# EAGLE design avr (EAGLE 5.07)
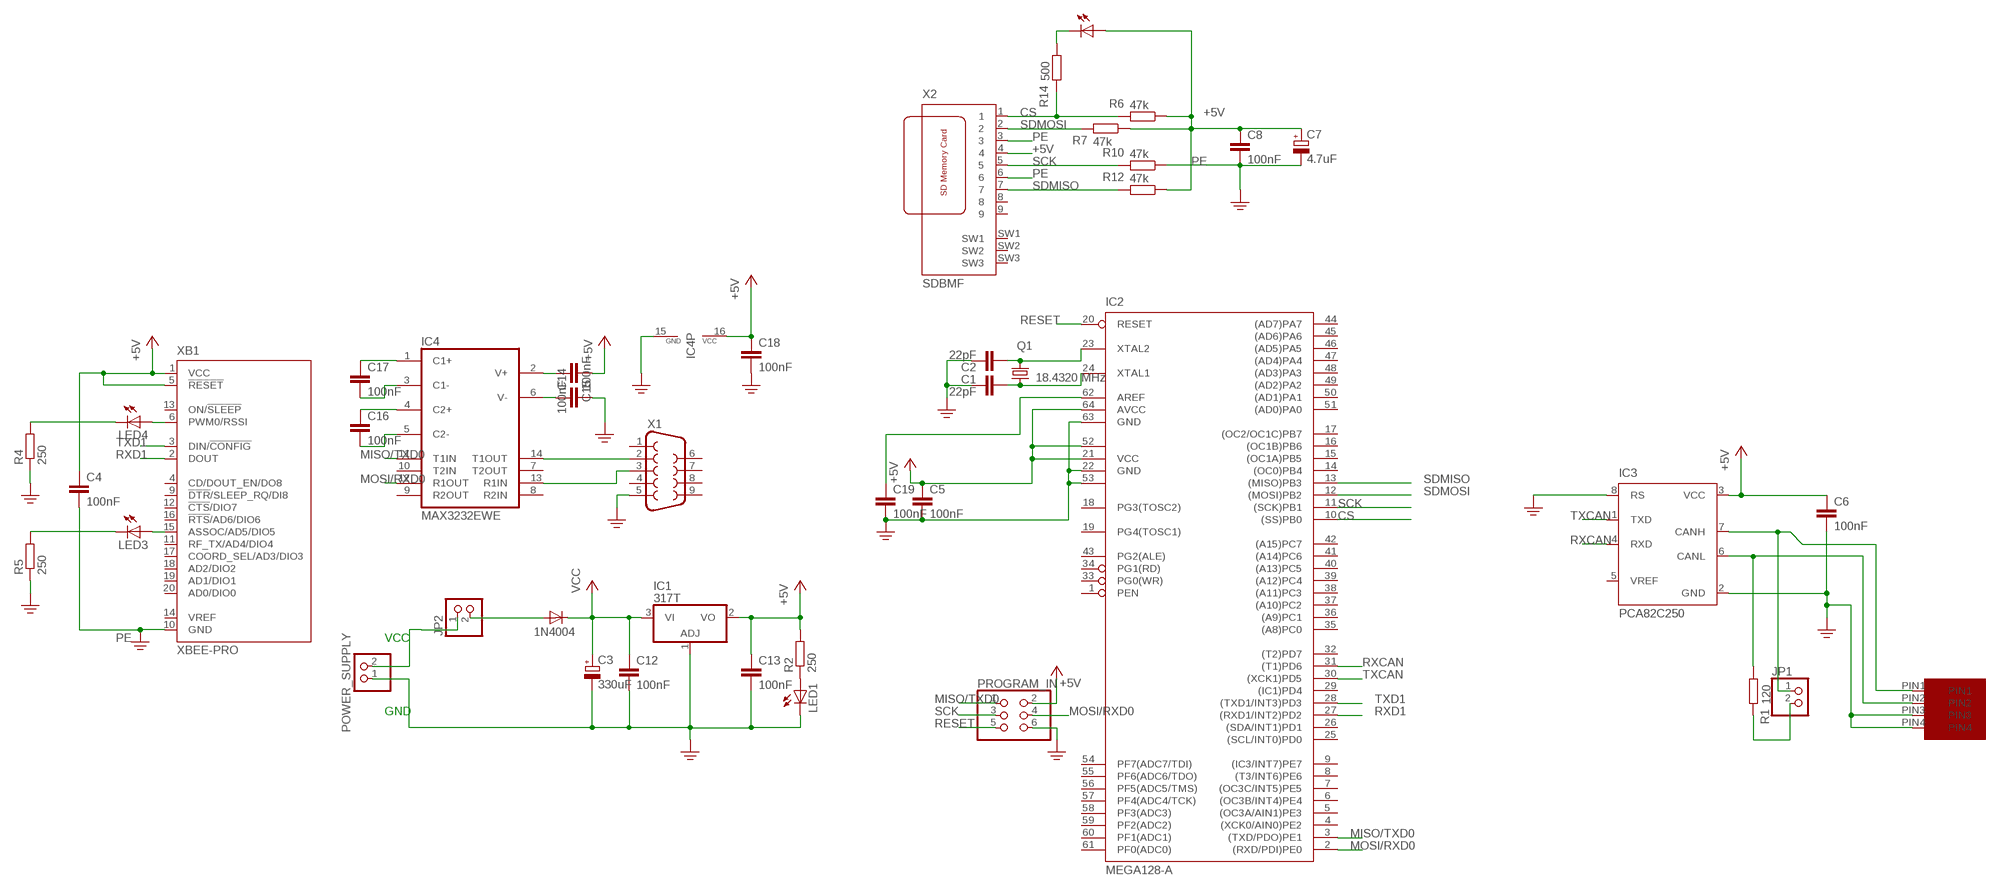
[diagram p0: schematic, sheet 1]

## Parts
C1  22pF  C5/2.5  [C5B2.5]
C2  22pF  C5/2.5  [C5B2.5]
C3  330uF  CPOL-EUE15-5AXIAL  [E15-5]
C4  100nF  C-EU050-024X044  [C050-024X044]
C5  100nF  C-EU050-024X044  [C050-024X044]
C6  100nF  C-EU050-024X044  [C050-024X044]
C7  4.7uF  CPOL-EUE15-5AXIAL  [E15-5]
C8  100nF  C-EU050-024X044  [C050-024X044]
C12  100nF  C-EU050-024X044  [C050-024X044]
C13  100nF  C-EU050-024X044  [C050-024X044]
C14  100nF  C-EU050-024X044  [C050-024X044]
C15  100nF  C-EU050-024X044  [C050-024X044]
C16  100nF  C-EU050-024X044  [C050-024X044]
C17  100nF  C-EU050-024X044  [C050-024X044]
C18  100nF  C-EU050-024X044  [C050-024X044]
C19  100nF  C-EU050-024X044  [C050-024X044]
D1  1N4004  [DO41-10]
IC1  317T  [TO220H]
IC2  MEGA128-A  [TQFP64]
IC3  PCA82C250  [DIL08]
IC4  MAX3232EWE  [SO16L]
JP1  PINHD-1X2  [1X02]
JP2  PINHD-1X2  [1X02]
LED1  LED5MM  [LED5MM]
LED3  LED5MM  [LED5MM]
LED4  LED5MM  [LED5MM]
LED5  LED5MM  [LED5MM]
POWER_SUPPLY  PINHD-1X2  [1X02]
PROGRAM_IN  PINHD-2X3  [2X03]
Q1  18.4320 MHz  CRYSTALHC49U70  [HC49U70]
R1  120  R-EU_0207/10  [0207/10]
R2  250  R-EU_0207/10  [0207/10]
R4  250  R-EU_0207/10  [0207/10]
R5  250  R-EU_0207/10  [0207/10]
R6  47k  R-EU_0207/10  [0207/10]
R7  47k  R-EU_0207/10  [0207/10]
R10  47k  R-EU_0207/10  [0207/10]
R12  47k  R-EU_0207/10  [0207/10]
R14  500  R-EU_0207/10  [0207/10]
U$1  MICROFIT4  [MICROFIT4SOCK]
X1  F09HP  [F09HP]
X2  SDBMF  [SDBMF-009XXBXX2]
XB1  XBEE-PRO  [XBEE-PRO]

## Nets
+5V: C4.1 C5.1 C6.1 C7.+ C8.1 C13.1 C15.1 C18.1 IC1.2(VO) IC2.21(VCC) IC2.52(VCC1) IC2.64(AVCC) IC3.3(VCC) IC4.16(VCC) LED5.A PROGRAM_IN.2 R2.2 R6.1 R7.1 R12.1 X2.4 XB1.1(VCC) XB1.5(!RESET)
CANJUMP1: IC3.7(CANH) JP1.1 U$1.PIN1
CANJUMP2: JP1.2 R1.2
CS: IC2.10((SS)PB0) R6.2 R14.2 X2.1
MISO/TXD0: IC2.3((TXD/PDO)PE1) IC4.11(T1IN) PROGRAM_IN.1
MOSI/RXD0: IC2.2((RXD/PDI)PE0) IC4.12(R1OUT) PROGRAM_IN.4
N$1: C1.2 IC2.24(XTAL1) Q1.1
N$2: C2.2 IC2.23(XTAL2) Q1.2
N$4: D1.A JP2.2
N$5: JP2.1 POWER_SUPPLY.2
N$6: LED1.A R2.1
N$10: C19.1 IC2.62(AREF)
N$21: IC4.13(R1IN) X1.3
N$33: IC4.14(T1OUT) X1.2
N$35: C17.1 IC4.1(C1+)
N$36: C17.2 IC4.3(C1-)
N$37: C16.1 IC4.4(C2+)
N$38: C16.2 IC4.5(C2-)
N$39: C14.1 IC4.6(V-)
N$41: C15.2 IC4.2(V+)
N$50: LED4.A XB1.6(PWM0/RSSI)
N$51: IC3.6(CANL) R1.1 U$1.PIN2
N$52: LED3.A XB1.15(ASSOC/AD5/DIO5)
N$57: LED4.K(C) R4.2
N$58: LED3.K(C) R5.2
N$59: LED5.K(C) R14.1
PE: C1.1 C2.1 C3.- C4.2 C5.2 C6.2 C7.- C8.2 C12.2 C13.2 C14.2 C18.2 C19.2 IC1.1(ADJ) IC2.22(GND) IC2.53(GND1) IC2.63(GND) IC3.2(GND) IC3.8(RS) IC4.15(GND) LED1.K(C) POWER_SUPPLY.1 PROGRAM_IN.6 R4.1 R5.1 R10.1 U$1.PIN3 U$1.PIN4 X1.5 X2.3 X2.6 XB1.10(GND)
RESET: IC2.20(RESET) PROGRAM_IN.5
RXCAN: IC2.31((T1)PD6) IC3.4(RXD)
RXD1: IC2.27((RXD1/INT2)PD2) XB1.2(DOUT)
SCK: IC2.11((SCK)PB1) PROGRAM_IN.3 R10.2 X2.5
SDMISO: IC2.13((MISO)PB3) R12.2 X2.7
SDMOSI: IC2.12((MOSI)PB2) R7.2 X2.2
TXCAN: IC2.30((XCK1)PD5) IC3.1(TXD)
TXD1: IC2.28((TXD1/INT3)PD3) XB1.3(DIN/!CONFIG)
VCC: C3.+ C12.1 D1.C IC1.3(VI)
Unconnected: IC2.1(PEN) IC2.4((XCK0/AIN0)PE2) IC2.5((OC3A/AIN1)PE3) IC2.6((OC3B/INT4)PE4) IC2.7((OC3C/INT5)PE5) IC2.8((T3/INT6)PE6) IC2.9((IC3/INT7)PE7) IC2.14((OC0)PB4) IC2.15((OC1A)PB5) IC2.16((OC1B)PB6) IC2.17((OC2/OC1C)PB7) IC2.18(PG3(TOSC2)) IC2.19(PG4(TOSC1)) IC2.25((SCL/INT0)PD0) IC2.26((SDA/INT1)PD1) IC2.29((IC1)PD4) IC2.32((T2)PD7) IC2.33(PG0(WR)) IC2.34(PG1(RD)) IC2.35((A8)PC0) IC2.36((A9)PC1) IC2.37((A10)PC2) IC2.38((A11)PC3) IC2.39((A12)PC4) IC2.40((A13)PC5) IC2.41((A14)PC6) IC2.42((A15)PC7) IC2.43(PG2(ALE)) IC2.44((AD7)PA7) IC2.45((AD6)PA6) IC2.46((AD5)PA5) IC2.47((AD4)PA4) IC2.48((AD3)PA3) IC2.49((AD2)PA2) IC2.50((AD1)PA1) IC2.51((AD0)PA0) IC2.54(PF7(ADC7/TDI)) IC2.55(PF6(ADC6/TDO)) IC2.56(PF5(ADC5/TMS)) IC2.57(PF4(ADC4/TCK)) IC2.58(PF3(ADC3)) IC2.59(PF2(ADC2)) IC2.60(PF1(ADC1)) IC2.61(PF0(ADC0)) IC3.5(VREF) IC4.7(T2OUT) IC4.8(R2IN) IC4.9(R2OUT) IC4.10(T2IN) X1.1 X1.4 X1.6 X1.7 X1.8 X1.9 X2.8 X2.9 X2.SW1 X2.SW2 X2.SW3 XB1.4(CD/DOUT_EN/DO8) XB1.9(!DTR!/SLEEP_RQ/DI8) XB1.11(RF_TX/AD4/DIO4) XB1.12(!CTS!/DIO7) XB1.13(ON/!SLEEP) XB1.14(VREF) XB1.16(!RTS!/AD6/DIO6) XB1.17(COORD_SEL/AD3/DIO3) XB1.18(AD2/DIO2) XB1.19(AD1/DIO1) XB1.20(AD0/DIO0)

## Notes on the sheet
- VCC
- GND

## Library data of the parts
C1 C2 = capacitor-wima:C: CAPACITOR naming: grid - package width
C3 C7 = rcl:CPOL-EU: POLARIZED CAPACITOR, European symbol
C4-C6 C8 C12-C19 = rcl:C-EU: CAPACITOR, European symbol
D1 = diode:1N4004: DIODE general purpose rectifier, 1 A
IC1 = linear:*317: Positive VOLTAGE REGULATOR
IC2 = atmel:MEGA128: MICROCONTROLLER 128 Kbytes FLASH 4 Kbytes SRAM 4 Kbytes EEPROM DUAL USART 8-channel 10 bit ADC Source: avr.lbr
IC3 = micro-philips:PCA82C250: CAN CONTROLLER INTERFACE
IC4 = maxim:MAX3232*: True RS-232 Transceivers 3.0V to 5.5V, Low-Power up to 1Mbps, Using Four 0.1µF External Capacitors Source: http://pdfserv.maxim-ic.com/en/ds/MAX3222-MAX3241.pdf
JP1 JP2 POWER_SUPPLY = pinhead:PINHD-1X2: PIN HEADER
LED1 LED3-LED5 = led:LED: LED OSRAM: - CHIPLED LG R971, LG N971, LY N971, LG Q971, LY Q971, LO R971, LY R971 LH N974, LH R974 LS Q976, LO Q976, LY Q976 LO Q996 - Hyper CHIPLED LW Q18S LB Q993, LB Q99A, LB R99A - SideLED LS A670, LO A670, LY A670, LG A670, LP A670 LB A673, LV A673, LT A673, LW A673 LH A674 LY A675 LS A676, LA A676, LO A676, LY A676, LW A676 LS A679, LY A679, LG A679 - Hyper Micro SIDELED® LS Y876, LA Y876, LO Y876, LY Y876 LT Y87S - SmartLED LW L88C, LW L88S LB L89C, LB L89S, LG L890 LS L89K, LO L89K, LY L89K LS L896, LA L896, LO L896, LY L896 - TOPLED LS T670, LO T670, LY T670, LG T670, LP T670 LSG T670, LSP T670, LSY T670, LOP T670, LYG T670 LG T671, LOG T671, LSG T671 LB T673, LV T673, LT T673, LW T673 LH T674 LS T676, LA T676, LO T676, LY T676, LB T676, LH T676, LSB T676, LW T676 LB T67C, LV T67C, LT T67C, LS T67K, LO T67K, LY T67K, LW E67C LS E67B, LA E67B, LO E67B, LY E67B, LB E67C, LV E67C, LT E67C LW T67C LS T679, LY T679, LG T679 LS T770, LO T770, LY T770, LG T770, LP T770 LB T773, LV T773, LT T773, LW T773 LH T774 LS E675, LA E675, LY E675, LS T675 LS T776, LA T776, LO T776, LY T776, LB T776 LHGB T686 LT T68C, LB T68C - Hyper Mini TOPLED® LB M676 - Mini TOPLED Santana® LG M470 LS M47K, LO M47K, LY M47K Source: http://www.osram.convergy.de LUXEON: - LUMILED® LXK2-PW12-R00, LXK2-PW12-S00, LXK2-PW14-U00, LXK2-PW14-V00 LXK2-PM12-R00, LXK2-PM12-S00, LXK2-PM14-U00 LXK2-PE12-Q00, LXK2-PE12-R00, LXK2-PE12-S00, LXK2-PE14-T00, LXK2-PE14-U00 LXK2-PB12-K00, LXK2-PB12-L00, LXK2-PB12-M00, LXK2-PB14-N00, LXK2-PB14-P00, LXK2-PB14-Q00 LXK2-PR12-L00, LXK2-PR12-M00, LXK2-PR14-Q00, LXK2-PR14-R00 LXK2-PD12-Q00, LXK2-PD12-R00, LXK2-PD12-S00 LXK2-PH12-R00, LXK2-PH12-S00 LXK2-PL12-P00, LXK2-PL12-Q00, LXK2-PL12-R00 Source: www.luxeon.com KINGBRIGHT: KA-3528ASYC Source: www.kingbright.com
PROGRAM_IN = pinhead:PINHD-2X3: PIN HEADER
Q1 = crystal:CRYSTAL: CRYSTAL
R1 R2 R4-R7 R10 R12 R14 = resistor:R-EU_: RESISTOR, European symbol
U$1 = UNICORN:MICROFIT4
X1 = con-subd:F09: SUB-D
X2 = farnell:SDBMF: SD MEMORY CARD PUSH-PUSH WITH CONNECTOR TYPE B (BIG SWUÌTCH #3) KINGFONT PRECISION INDUSTIAL CO., LTD Source: http://www.farnell.com/datasheets/74273.pdf Best.-Nr.: 9186174 Hersteller: MULTICOMP Herstellerbez.: SDBMF-00915B0T2
XB1 = maxstream:XBEE: XBee (TM) /XBee-PRO(TM) OEM RF Modules Source: MaxStream, Inc. xbee_productmanual.pdf

## Board
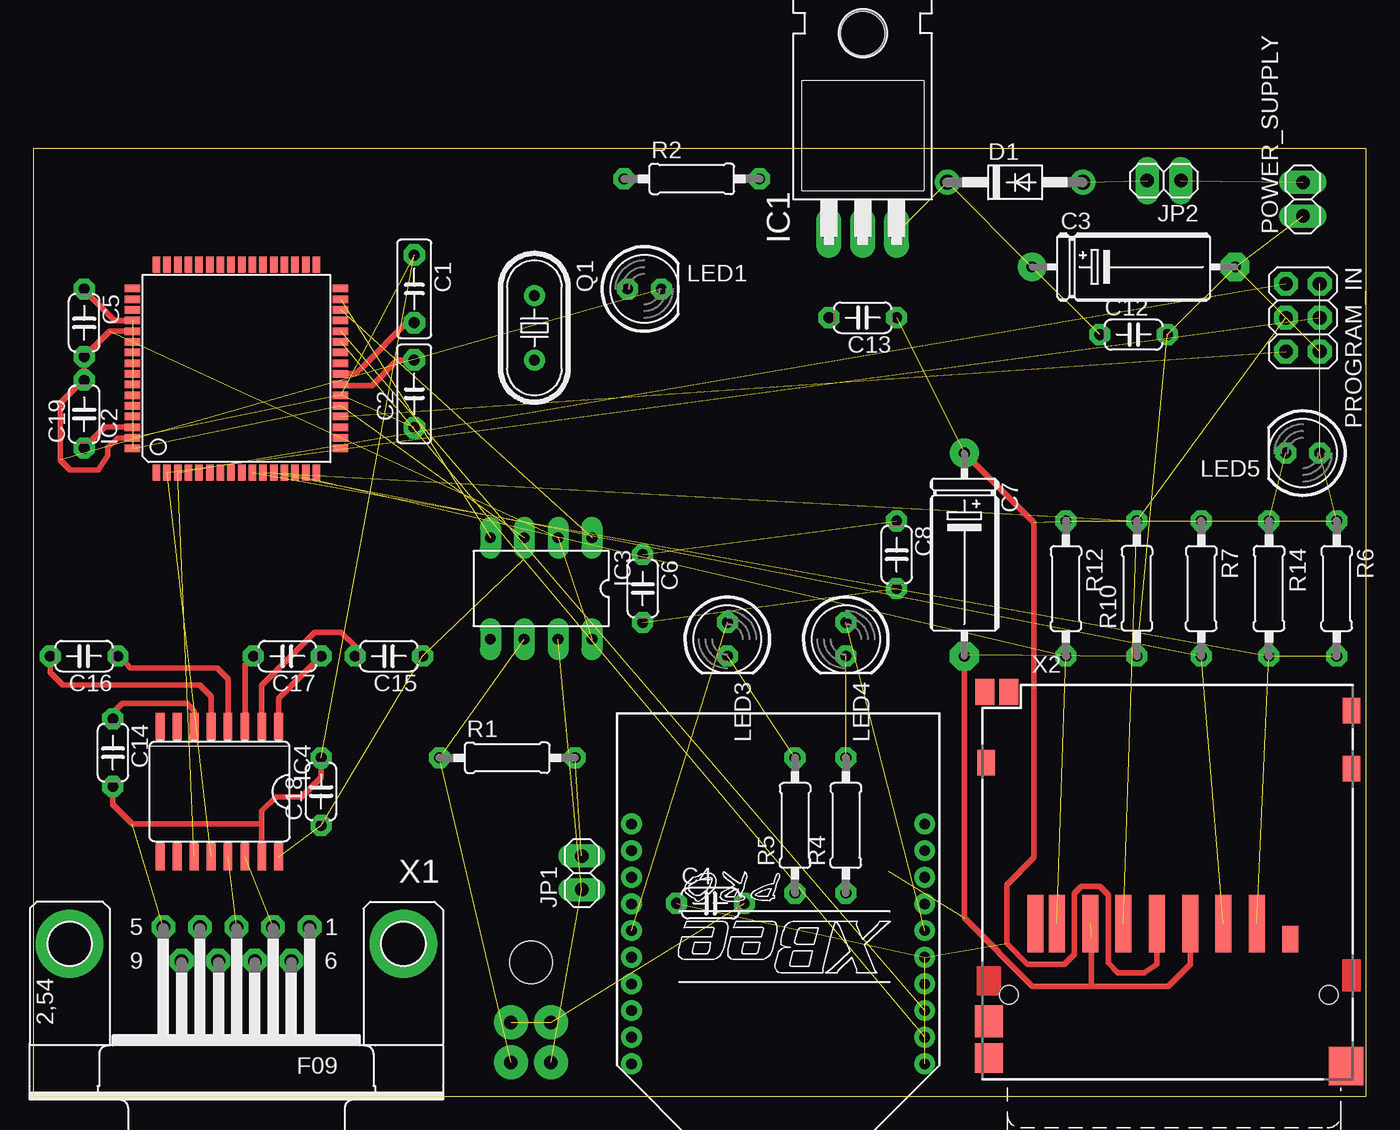
[diagram p1: board, top side]
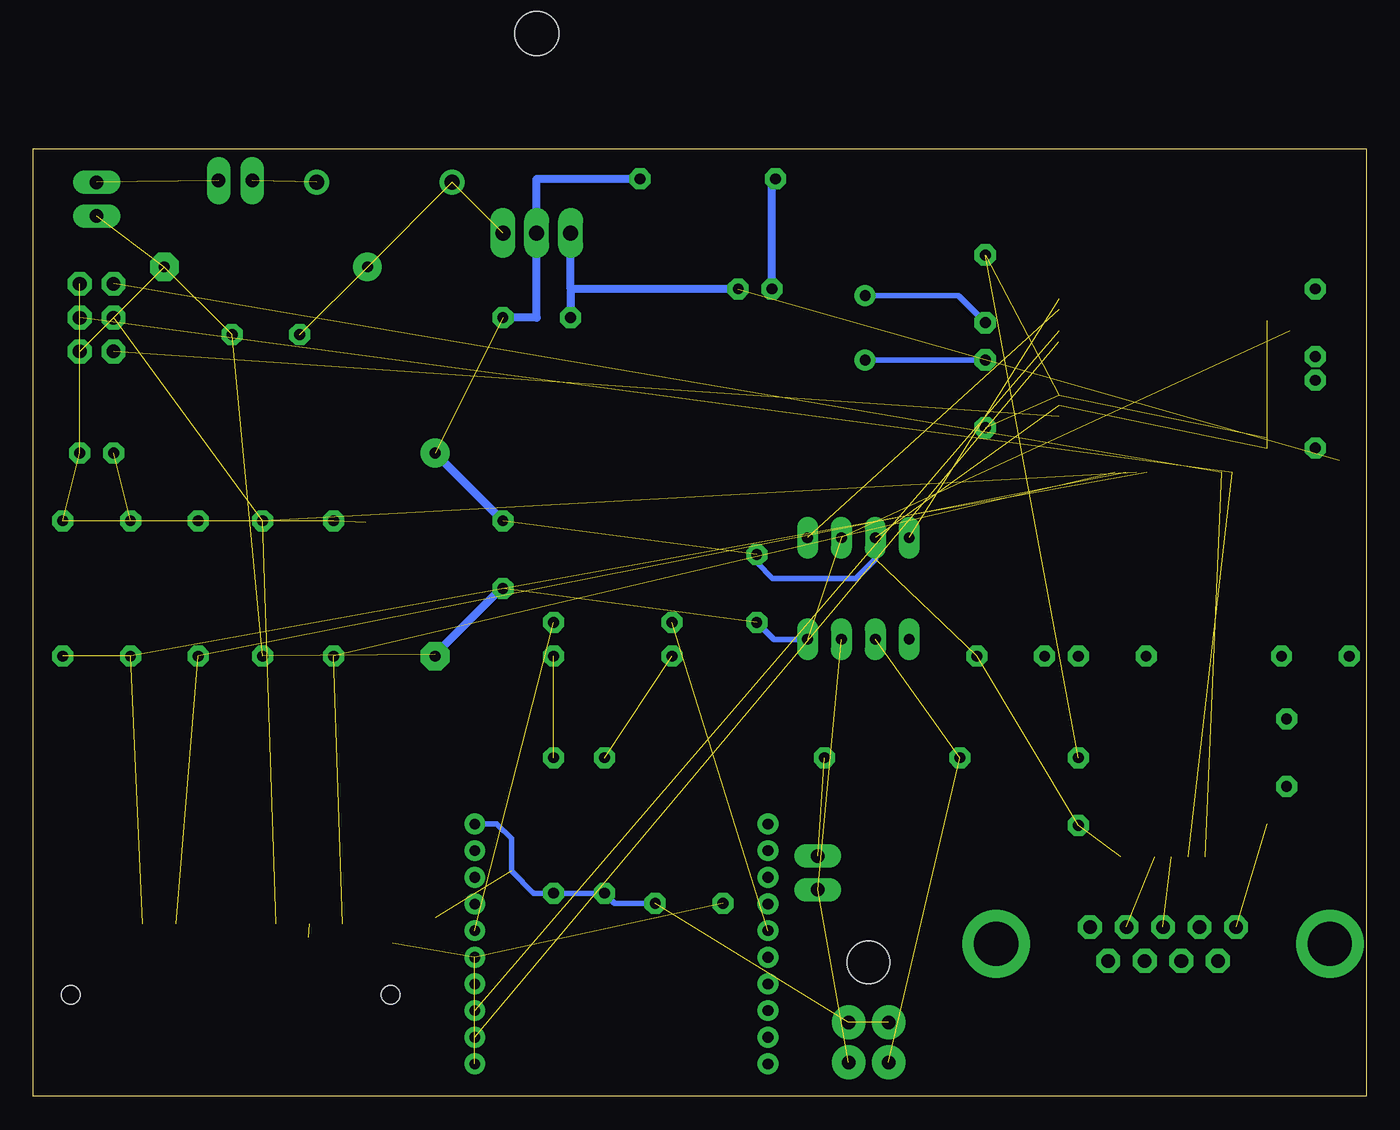
[diagram p2: board, bottom side, seen from below]

Size 100 x 71.11 mm. Coordinates in mm from the lower left corner, seen from the top.
Outline: 0,0 100,0 100,71.11 0,71.11 0,0
Copper layers (1*16): Top 0.035mm / dielectric 1.5mm / Bottom 0.035mm
Design rules "default *": minimum track width 10mil, minimum drill 24mil, track to track 12mil, track to pad 12mil, pad to pad 8mil, via to via 12mil, smd to smd 8mil, copper to edge 40mil, drill to drill 8mil, minimum pad ring 15mil, minimum via ring 8mil, stop-mask expansion 4mil, vias tented up to drill 0mil, thermal gap 10mil
tRestrict: area 43.2,1.3 to 45.7,21.6; area 66,1.3 to 68.6,21.6; area 33,40.6 to 43.2,43.2; area 33,33 to 43.2,35.6; area 35.4,1.9 to 39.2,7; area 34.3,1.3 to 40.6,6.3; area 59.7,31.8 to 62.2,36.8; area 50.8,31.8 to 53.3,35.6; area 50.8,35.6 to 53.3,36.8; area 92.7,47 to 97.8,49.5; area 94,64.8 to 96.5,69.8; area 92.7,54.6 to 97.8,62.2; 7 more areas

### Footprints (pad centres in the part's own frame; a part is rotated, then mirrored left to right if it is on the bottom)
C5B2.5 = drill 0.813 pad 1.6 octagon: 1 -2.54,0; 2 2.54,0
E15-5 = drill 0.813 pad 2.159 round: + -7.62,0 | drill 0.813 pad 2.159 octagon: - 7.62,0
C050-024X044 = drill 0.813 octagon: 1 -2.54,0; 2 2.54,0
DO41-10 = drill 1.118 round: A 5.08,0; C -5.08,0
TO220H = drill 1.118 long: 1 -2.54,-10.16; 2 0,-10.16; 3 2.54,-10.16 | hole 3.302: 0,4.826
TQFP64 = smd 1.194 x 0.559: 1 -7.8,6; 2 -7.8,5.2; 3 -7.8,4.4; 4 -7.8,3.6; 5 -7.8,2.8; 6 -7.8,2; 7 -7.8,1.2; 8 -7.8,0.4; 9 -7.8,-0.4; 10 -7.8,-1.2; 11 -7.8,-2; 12 -7.8,-2.8; 13 -7.8,-3.6; 14 -7.8,-4.4; 15 -7.8,-5.2; 16 -7.8,-6; 33 7.8,-6; 34 7.8,-5.2; 35 7.8,-4.4; 36 7.8,-3.6; 37 7.8,-2.8; 38 7.8,-2; 39 7.8,-1.2; 40 7.8,-0.4; 41 7.8,0.4; 42 7.8,1.2; 43 7.8,2; 44 7.8,2.8; 45 7.8,3.6; 46 7.8,4.4; 47 7.8,5.2; 48 7.8,6 | smd 0.559 x 1.194: 17 -6,-7.8; 18 -5.2,-7.8; 19 -4.4,-7.8; 20 -3.6,-7.8; 21 -2.8,-7.8; 22 -2,-7.8; 23 -1.2,-7.8; 24 -0.4,-7.8; 25 0.4,-7.8; 26 1.2,-7.8; 27 2,-7.8; 28 2.8,-7.8; 29 3.6,-7.8; 30 4.4,-7.8; 31 5.2,-7.8; 32 6,-7.8; 49 6,7.8; 50 5.2,7.8; 51 4.4,7.8; 52 3.6,7.8; 53 2.8,7.8; 54 2,7.8; 55 1.2,7.8; 56 0.4,7.8; 57 -0.4,7.8; 58 -1.2,7.8; 59 -2,7.8; 60 -2.8,7.8; 61 -3.6,7.8; 62 -4.4,7.8; 63 -5.2,7.8; 64 -6,7.8
DIL08 = drill 0.813 long: 1 -3.81,-3.81; 2 -1.27,-3.81; 3 1.27,-3.81; 4 3.81,-3.81; 5 3.81,3.81; 6 1.27,3.81; 7 -1.27,3.81; 8 -3.81,3.81
SO16L = smd 0.66 x 2.032: 1 -4.445,-4.902; 2 -3.175,-4.902; 3 -1.905,-4.902; 4 -0.635,-4.902; 5 0.635,-4.902; 6 1.905,-4.902; 7 3.175,-4.902; 8 4.445,-4.902; 9 4.445,4.902; 10 3.175,4.902; 11 1.905,4.902; 12 0.635,4.902; 13 -0.635,4.902; 14 -1.905,4.902; 15 -3.175,4.902; 16 -4.445,4.902
1X02 = drill 1.016 long: 1 -1.27,0; 2 1.27,0
LED5MM = drill 0.813 octagon: A -1.27,0; K 1.27,0
2X03 = drill 1.016 octagon: 1 -2.54,-1.27; 2 -2.54,1.27; 3 0,-1.27; 4 0,1.27; 5 2.54,-1.27; 6 2.54,1.27
HC49U70 = drill 0.813 round: 1 -2.413,0; 2 2.413,0
0207/10 = drill 0.813 octagon: 1 -5.08,0; 2 5.08,0
MICROFIT4SOCK = drill 1 pad 2.54 round: PIN1 -2,0; PIN2 1,0; PIN3 -2,-3; PIN4 1,-3 | hole 3.2: -0.5,-7.5
F09HP = drill 1.016 octagon: 1 -5.486,-1.27; 2 -2.743,-1.27; 3 0,-1.27; 4 2.743,-1.27; 5 5.486,-1.27; 6 -4.115,1.27; 7 -1.372,1.27; 8 1.372,1.27; 9 4.115,1.27 | drill 3.302 pad 5.08 round: G1 -12.522,0; G2 12.522,0
SDBMF-009XXBXX2 = smd 1.2 x 4.3: 1 6.7,5.325; 2 4.2,5.325; 3 1.7,5.325; 4 -0.8,5.325; 5 -3.3,5.325; 6 -5.8,5.325; 7 -8.3,5.325; 8 -9.925,5.325 | smd 1.2 x 2: 9 9.2,4.175 | smd 2.1 x 2.4: M1 -13.4,-2 | smd 2.6 x 2.9: M2 13.4,-5.35 | smd 1.3 x 1.9: M3 -13.6,17.4; M4 13.8,16.95; M5 13.8,21.3 | smd 1.4 x 1.95: SW1 -11.9,22.7; SW3 -13.7,22.7 | smd 2.1 x 2.2: SW2 -13.4,-4.75 | hole 1.4: -11.9,0; 12.1,0
XBEE-PRO = drill 0.8 pad 1.27 round: 1 -11,9; 2 -11,7; 3 -11,5; 4 -11,3; 5 -11,1; 6 -11,-1; 7 -11,-3; 8 -11,-5; 9 -11,-7; 10 -11,-9; 11 11,-9; 12 11,-7; 13 11,-5; 14 11,-3; 15 11,-1; 16 11,1; 17 11,3; 18 11,5; 19 11,7; 20 11,9

### Placement (x,y rotation side)
C1  28.57,60.58 270 top
C2  28.57,52.7 90 top
C3  82.55,62.23 0 top
C4  50.8,14.48 0 top
C5  3.81,58.04 270 top
C6  45.72,38.1 270 top
C7  69.85,40.64 270 top
C8  64.77,40.64 270 top
C12  82.55,57.15 0 top
C13  62.23,58.42 180 top
C14  5.97,25.78 270 top
C15  26.67,33.02 180 top
C16  3.81,33.02 180 top
C17  19.05,33.02 180 top
C18  21.59,22.86 90 top
C19  3.81,51.18 90 top
D1  73.66,68.58 0 top
IC1  62.23,74.93 0 top
IC2  15.24,54.61 90 top
IC3  38.1,38.1 180 top
IC4  13.97,22.86 180 top
JP1  41.15,16.76 90 top
JP2  84.84,68.71 180 top
LED1  45.85,60.58 0 top
LED3  52.07,34.29 270 top
LED4  60.96,34.29 270 top
LED5  95.25,48.26 180 top
POWER_SUPPLY  95.25,67.31 90 top
PROGRAM_IN  95.25,58.42 270 top
Q1  37.59,57.66 270 top
R1  35.56,25.4 0 top
R2  49.4,68.83 0 top
R4  60.96,20.32 90 top
R5  57.15,20.32 90 top
R6  97.79,38.1 270 top
R7  87.63,38.1 270 top
R10  82.8,38.1 90 top
R12  77.47,38.1 270 top
R14  92.71,38.1 270 top
U$1  36.83,2.54 180 top
X1  15.24,11.43 180 top
X2  85.09,7.62 0 top
XB1  55.88,11.43 180 top

### Tracks (layer width: path | path; a pad name or v marks a point on that pad's centre or on a via)
+5V  (16 unrouted)
  Top 0.406: IC2.52 6.1,58.21 3.81,60.5 C5.1 | C7.+ 75.06,43.05 75.06,17.91 73.03,15.88 73.03,11.48 74.6,9.91 77.36,9.91 78.11,10.65 78.11,15.21 78.64,15.75 80.01,15.75 80.64,15.11 80.64,10.01 81.39,9.27 83.37,9.27 84.29,9.88 X2.4
  Bottom 0.406: IC3.3 36.83,40.31 38.28,38.86 44.55,38.86 45.72,40.03 C6.1
  Bottom 0.61: C7.+ C8.1 | C13.1 62.23,58.42 IC1.2 62.23,68.83 R2.2
CANJUMP1  (2 unrouted)
CANJUMP2  (1 unrouted)
CS  (3 unrouted)
MISO/TXD0  (2 unrouted)
MOSI/RXD0  (2 unrouted)
N$1
  Top 0.406: C1.2 28.01,58.04 24.77,54.8 24.2,54.23 23.04,54.23 IC2.24
  Bottom 0.406: Q1.1 30.61,60.07 C1.2
N$2
  Top 0.406: C2.2 27.3,55.24 25.4,53.34 23.04,53.34 IC2.23
  Bottom 0.406: Q1.2 C2.2
N$4  (1 unrouted)
N$5  (1 unrouted)
N$6
  Bottom 0.61: R2.1 44.58,68.83 LED1.A
N$10
  Top 0.406: IC2.62 5.36,50.21 3.81,48.66 C19.1
N$21  (1 unrouted)
N$33  (1 unrouted)
N$35
  Top 0.406: C17.1 18.41,29.84 IC4.1
N$36
  Top 0.406: C17.2 15.88,32.38 IC4.3
N$37
  Top 0.406: C16.1 6.48,33.02 7.26,32.15 7.47,32.13 13.79,32.13 14.61,31.32 IC4.4
N$38
  Top 0.406: C16.2 1.27,31.79 2.19,30.86 12.48,30.86 13.34,30.01 IC4.5
N$39
  Top 0.406: C14.1 5.97,28.75 6.69,29.46 11.53,29.46 12.06,28.93 IC4.6
N$41
  Top 0.406: IC4.2 17.14,30.82 21.12,34.8 23.11,34.8 24.13,33.77 C15.2
N$50  (1 unrouted)
N$51  (2 unrouted)
N$52  (1 unrouted)
N$57  (1 unrouted)
N$58  (1 unrouted)
N$59  (1 unrouted)
PE  (18 unrouted)
  Top 0.406: 17.14,20.45 17.14,21.4 18.22,22.48 20.14,22.48 21.59,23.93 C18.2 | 17.14,20.45 IC4.15 | C14.2 5.97,21.89 7.42,20.45 17.14,20.45 | IC2.53 5.72,57.41 C5.2 C19.2 3.76,53.72 2.03,51.99 2.03,47.73 2.77,46.99 4.87,46.99 5.59,48.09 5.59,48.66 6.33,49.4 IC2.63 | C7.- 69.85,13.37 74.97,8.26 79.38,8.26 | 79.38,8.26 79.38,11.94 | 79.38,8.26 85.16,8.26 86.79,9.89 X2.3
  Bottom 0.406: C4.2 56.39,14.48 R5.1 R4.1 62.48,15.24 64.14,16.9 64.14,19.36 65.23,20.45 66.88,20.45 XB1.10 | IC3.8 44.45,34.29 C6.2
  Bottom 0.61: C7.- 69.85,33.17 64.92,38.1 C8.2 | LED1.K 59.69,60.58 | 59.69,60.58 C13.2 | 59.69,60.58 IC1.1
RESET  (1 unrouted)
RXCAN  (1 unrouted)
RXD1  (1 unrouted)
SCK  (3 unrouted)
SDMISO  (2 unrouted)
SDMOSI  (2 unrouted)
TXCAN  (1 unrouted)
TXD1  (1 unrouted)
VCC  (3 unrouted)